# Altium schematic sheet CANBUS.SchDoc
size A; SheetNumber: 1; SheetTotal: 9
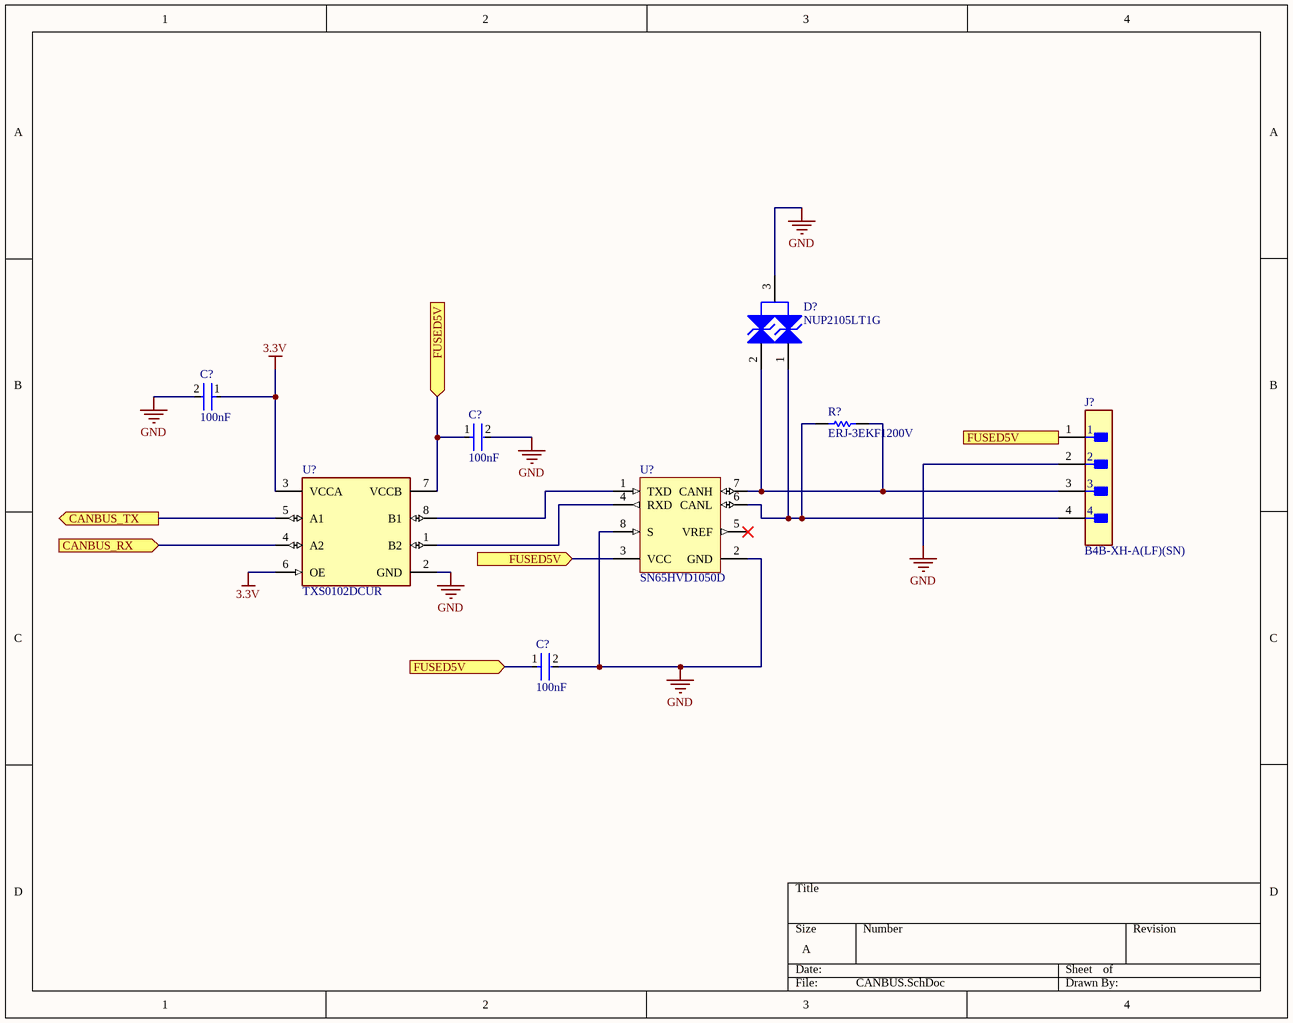
[diagram p0: CANBUS.SchDoc]

## Parts
(Parts that share a designator on the sheet are numbered #1, #2 ... from top to bottom, then left to right.)
C?#1  Capacitance: 100nF  [FP-GRM033-0_03-IPC_C]  (hidden comment: GRM033R61A104KE15D)
C?#2  Capacitance: 100nF  [FP-GRM033-0_03-IPC_C]  (hidden comment: GRM033R61A104KE15D)
C?#3  Capacitance: 100nF  [FP-GRM033-0_03-IPC_C]  (hidden comment: GRM033R61A104KE15D)
D?  NUP2105LT1G  [ONSC-SOT-23-3-318-08_V]
J?  B4B-XH-A(LF)(SN)  [FP-B4B-XH-A_LF_SN-MFG]
R?  ERJ-3EKF1200V  [RESC1609X55X30ML15T15]
U?#1  SN65HVD1050D  [D0008A_N]
U?#2  TXS0102DCUR  [FP-DCU0008A-MFG]

## Ports
CANBUS_RX (in), CANBUS_TX (out), FUSED5V (in)

## Nets
3.3V: C?#1.1 U?#2.3(VCCA) U?#2.6(OE)
GND: C?#1.2 C?#2.2 C?#3.2 D?.3(K) J?.2 U?#1.2(GND) U?#1.8(S) U?#2.2(GND)
CANBUS_RX: U?#2.4(A2) ; port CANBUS_RX
CANBUS_TX: U?#2.5(A1) ; port CANBUS_TX
FUSED5V: C?#2.1 C?#3.1 J?.1 U?#1.3(VCC) U?#2.7(VCCB) ; port FUSED5V
NetD?_1: D?.1(K) J?.4 R?.2 U?#1.6(CANL)
NetD?_2: D?.2(K) J?.3 R?.1 U?#1.7(CANH)
NetU?#1_1: U?#1.1(TXD) U?#2.8(B1)
NetU?#1_4: U?#1.4(RXD) U?#2.1(B2)

Not connected (* = marked no-connect by the designer): U?#1 5(VREF)*

## Library data of the parts
C?#1-C?#3 = CMP-2010-01264-2: Chip Multilayer Ceramic Capacitors for General Purpose, 0201, 0.10uF, X5R, 15%, 10%, 10V; Mount: Surface Mount; Dielectric: X5R; Width: 0.012inch; Tolerance: 10%; Radiation Hardening: No; Voltage Rating: 10V; REACH SVHC: No SVHC; Height: 0.3mm; Max Operating Temperature: 85°C; Voltage Rating (DC): 10V; Thickness: 0.013inch; Termination: SMD/SMT; Lead Free: Lead Free; Package Quantity: 1; Case/Package: 0201; Min Operating Temperature: -55°C; Weight: 6E-06oz; Length: 0.6mm; Case Code (Imperial): 0201; Depth: 0.3mm; Voltage: 10V; Packaging: Tape and Reel; Case Code (Metric): 0603
D? = CMP-1063-00164-1: Dual Line CAN Bus Protector, 3-Pin SOT-23, Pb-Free, Tape and Reel; Manufacturer: On Semiconductor; IR Max (uA): 0.1; Number of Lines: 2; Direction: Bidirectional; C Max (pF): 30; PPK Max (W): 350; V(BR) Min (V): 26.2; ComponentLink3URL: http://www.onsemi.cn/pub_link/Collateral/318-08.PDF; Mounting Technology: Surface Mount; ComponentLink2Description: Datasheet; PartNumber: NUP2105LT1G; ComponentLink1URL: http://www.onsemi.com/; PackageVersion: Rev. AP, 11/2009; DatasheetVersion: Rev. 5; RoHS: Pb-Free; PackageReference: SOT-23-3-318-08; ComponentLink2URL: http://www.onsemi.cn/pub_link/Collateral/NUP2105L-D.PDF; ComponentLink1Description: Manufacturer URL; PackageDescription: 3-Pin Small Outline Transistor, Body 2.92 x 1.3 mm, Pitch 0.95 mm; Packing: Tape and Reel; ComponentLink3Description: Package Specification
J? = CMP-17439-000250-1: CONN HEADER VERT 4POS 2.5MM; Number of Contacts: 4; Contact Resistance: 20mR; Voltage Rating: 250V; Max Current Rating: 3A; Gender: Male; Wire/Cable Gauge: 22AWG; Mated Stacking Heights: 9.8mm; Insulation Resistance: 1GR; Orientation: Straight; Contact Type: Male Pin; Contact Finish - Mating: TIN; Series: XH; Max Voltage Rating (AC): 250V; Lead Pitch: 2.5mm; Contact Shape: Square; Insulation Color: Natural; Termination: Solder; Lead Free: Lead Free; Voltage Rating (AC): 250V; Number of Rows: 1; Flammability Rating: UL94 V-0; Number of Positions: 4; Max Operating Temperature: 85°C; Package Quantity: 500; Mount: Through Hole; REACH SVHC: No SVHC; Connector Type: Header; Insulation Material: Nylon; Fastening Type: Detent; Min Operating Temperature: -25°C; Housing Color: White; Packaging: Bulk; Contact Plating: Tin; Contact Material: Brass; Max Voltage Rating (DC): 250V; Housing Material: Polyamide; Color: Natural; Material: Polyamide; Pitch: 2.5mm; Depth: 5.75mm; Current Rating: 3A; Length: 12.4mm
R? = CMP-2000-00213-2: Chip Resistor, 120 Ohm, +/- 1%, 0.1 W, -55 to 155 degC, 0603 (1608 Metric), RoHS, Tape and Reel; Manufacturer: Panasonic; Power Rating: 100mW; Voltage Rating (DC): 75V; Resistance: 120Ohm; Temperature Coefficient: 100ppm/degreesC; Number of Terminations: 2; Military Standard: Not; Tolerance: 1%; Min Operating Temperature: -55degC; Packaging: TapeandReel; Lead Free: LeadFree; Max Operating Temperature: 155degC; Manufacturer URL: http://www.panasonic.com/; Case Code (Imperial): 0603; REACH SVHC: NoSVHC; Width: 0.031inch; Datasheet URL: https://industrial.panasonic.com/cdbs/www-data/pdf/RDA0000/AOA0000C283.pdf; RoHSCompliant: true; Max Power Dissipation: 100mW; Termination: SMD/SMT; Package Reference: 0603; Height: 0.022inch; Depth: 0.8mm; Package Description: 2-Pin Surface Mount Device, Body 1.6 x 0.85 mm; Contact Plating: Tin; Length: 1.6mm; Package URL: http://www.st.com/st-web-ui/static/active/en/resource/technical/document/datasheet/CD00001320.pdf; Radiation Hardening: No; Package Quantity: 1; Number of Pins: 2; Datasheet Version: 42095.0; Voltage Rating: 75V; Composition: ThickFilm; Case/Package: 0603; Mount: SurfaceMount; Case Code (Metric): 1608
U?#1 = CMP-0315-00048-2: High-Speed EMC Optimized CAN Transceiver, 70 mA, 5 V, -40 to 125 degC, 8-pin SOIC (D), Green (RoHS & no Sb/Br); Manufacturer: Texas Instruments; Bus Fault Voltage(V): -4 to 16; Rating: Catalog; Drivers Per Package: 1; Transient Pulse Protection(V): -200 to 200; ICC(Max)(mA): 70; Supply Voltage(s)(V): 5; PackageVersion: revM, Jun-2011; PartNumber: SN65HVD1050D; PackageReference: D0008A; Code_JEDEC: MS-012AA; Isolated: No; ComponentLink1Description: Datasheet; PackageDescription: 8-Pin Plastic Small Outline Integrated Circuit, 4.9 x 3.9 mm, Pitch 1.27 mm Pitch; Receivers Per Package: 1; Footprint: TJA1050; DatasheetVersion: SLLS632B; SubFamily: CAN; ComponentLink1URL: http://www.ti.com/general/docs/lit/getliterature.tsp?genericPartNumber=SN65HVD1050&fileType=pdf; Eco-Plan: Green (RoHS & no Sb/Br); Mounting Technology: Surface Mount
U?#2 = CMP-0859-00001-2: IC TRNSLTR BIDIRECTIONAL US8; Manufacturer: Texas Instruments; Number Of Circuits: 1; Number Of Inputs: 2; Data Rate: 24Mbits/s; Max Junction Temp: +150°C; V A Min: 1.65V; Standoff Height: 0mm; Logic Function Desc: Bidirectional Voltage-Level Translator; Max Supply Voltage: 5.5V; V A Max: 3.6V; Nominal Supply Current: 1-14.4uA; V B Min: 2.3V; Temperature: -40°C to +85°C; Temperature Range Low: -40°C; Height: 0.9mm; Device Class L1: Integrated Circuits (ICs); RoHS: TRUE; Min Supply Voltage: 1.65V; Digikey Description: IC TRNSLTR BIDIRECTIONAL US8; ComponentLink2Description: Datasheet; Octopart: https://octopart.com/txs0102dcur-texas+instruments-5414308; Temperature Range High: +85°C; Device Class L2: Logic ICs; Category: IC; Ambient Temperature Range High: +85°C; Automotive: No; Manufacturer Part Number: TXS0102DCUR; Device Class L3: Voltage Level Shifters; Number Of Outputs: 2; Ambient Temperature Range Low: -40°C; Lead Free: Yes; ComponentLink2URL: http://www.ti.com/lit/ds/symlink/txs0102.pdf; V B Max: 5.5V; Package: DCU0008A; Mouser Description: Translation - Voltage Levels 2-Bit Bi-Directional Voltage-Level-Trans